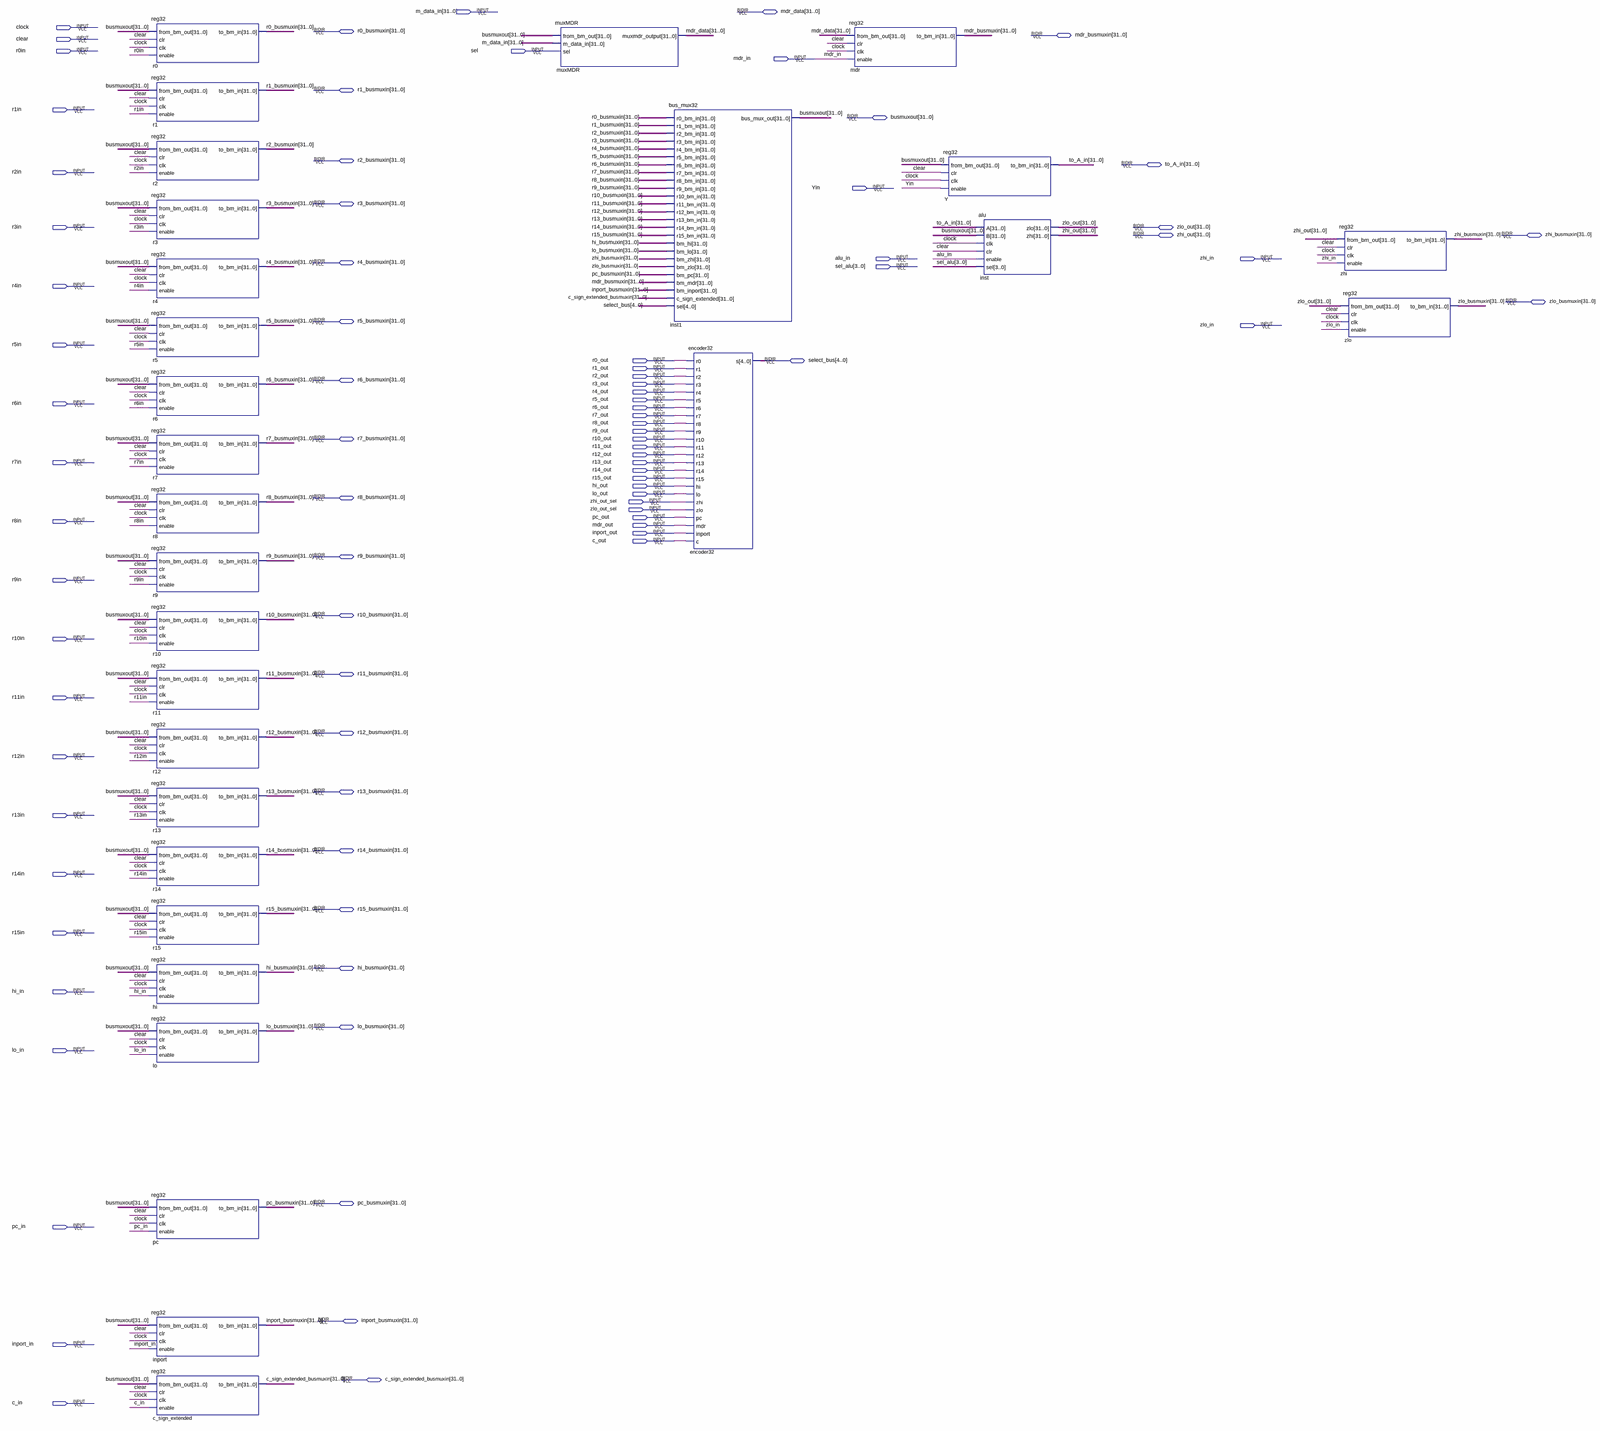
[diagram p0: schematic sheet, whole]
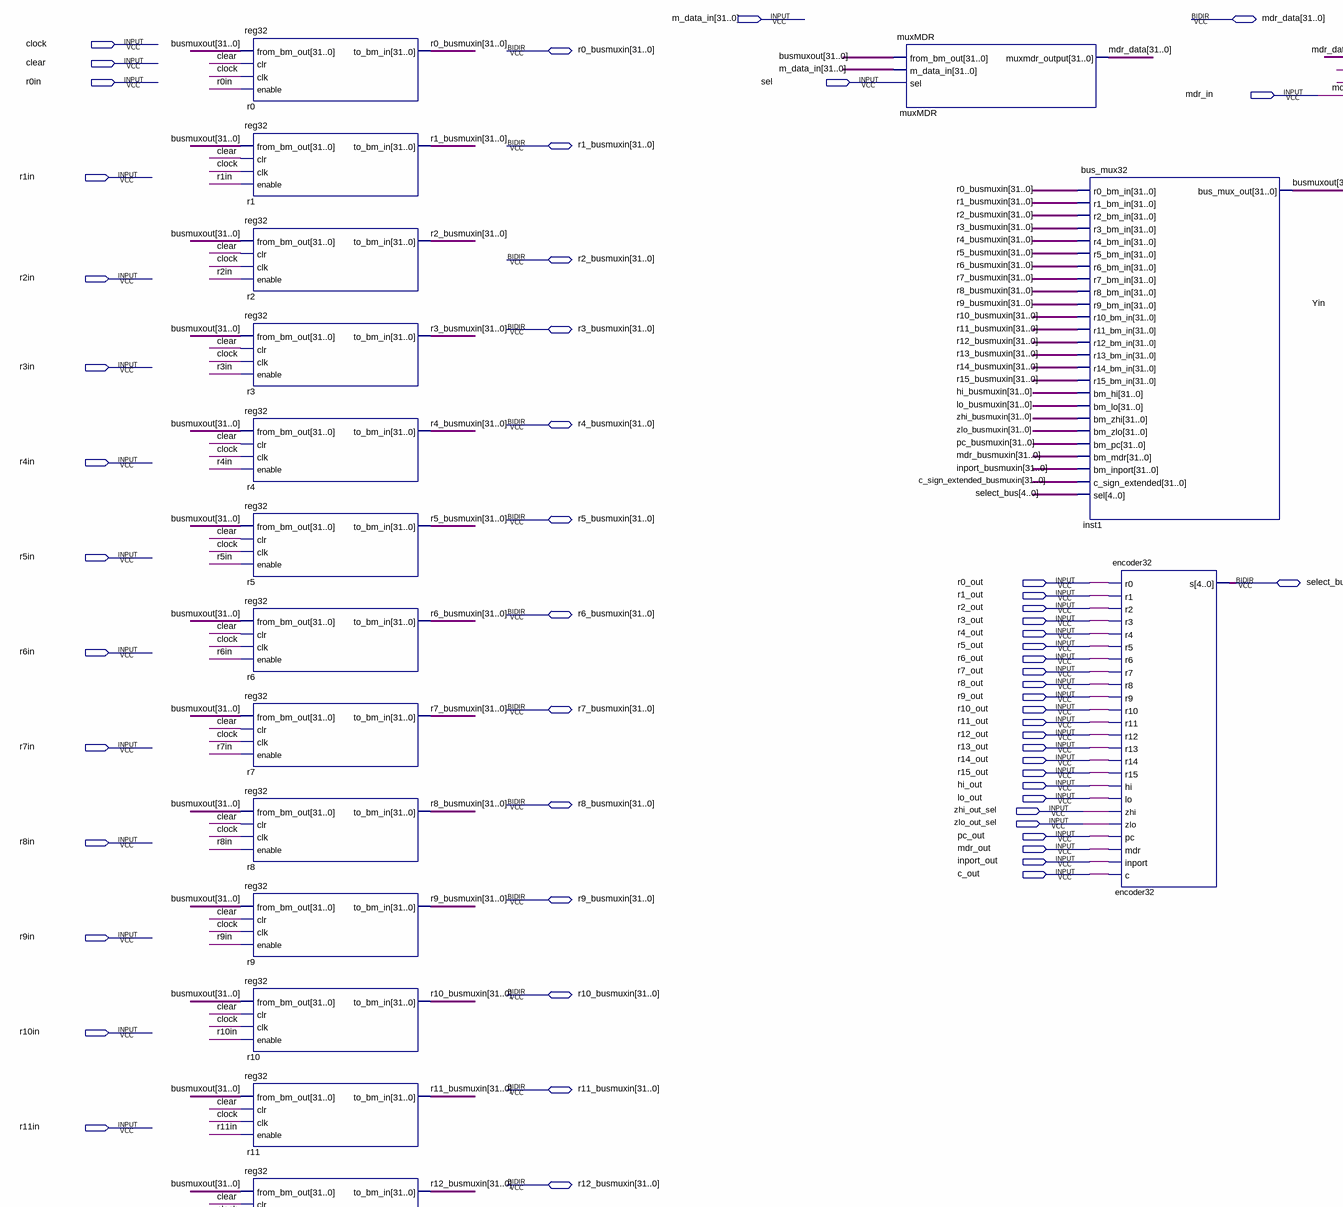
[diagram p1: schematic sheet, upper left part]
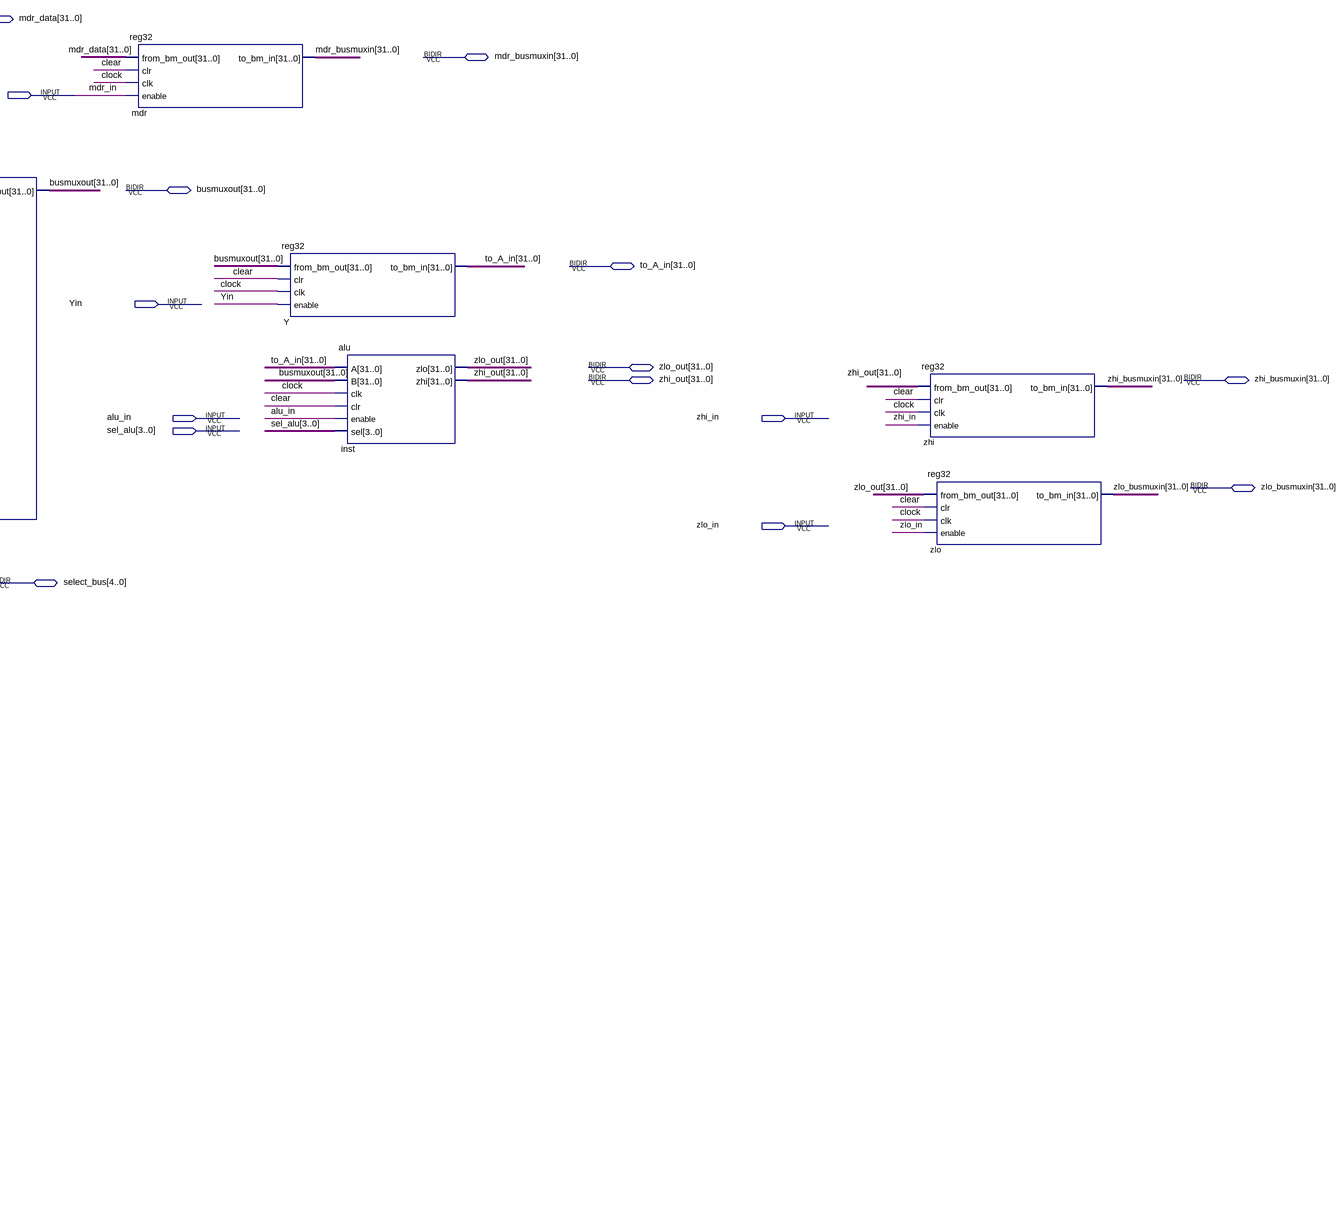
[diagram p2: schematic sheet, upper right part]
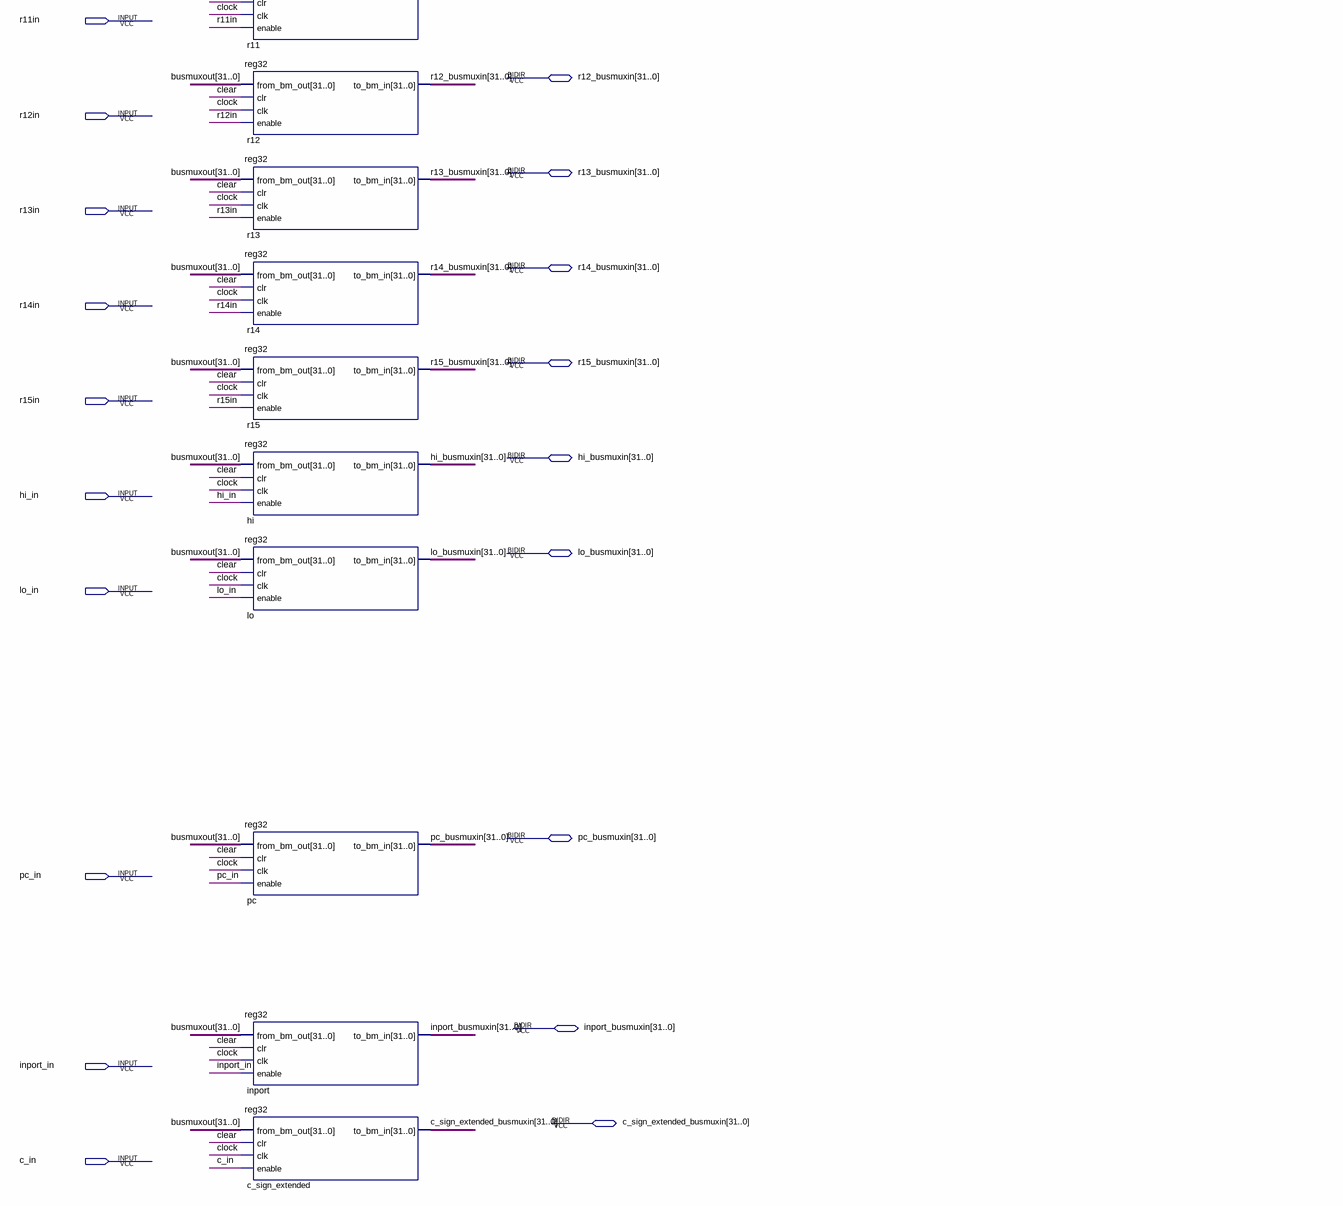
[diagram p3: schematic sheet, lower left part]
// Quartus schematic phase1.bdf as structural Verilog: 29 symbols, 85 pins
module phase1 (
  input  [31:0] m_data_in,
  input  clock,
  input  clear,
  input  r0in,
  input  sel,
  input  mdr_in,
  input  r1in,
  input  r2in,
  input  Yin,
  input  r3in,
  input  alu_in,
  input  zhi_in,
  input  [3:0] sel_alu,
  input  r4in,
  input  zlo_in,
  input  r5in,
  input  r0_out,
  input  r1_out,
  input  r2_out,
  input  r3_out,
  input  r4_out,
  input  r5_out,
  input  r6in,
  input  r6_out,
  input  r7_out,
  input  r8_out,
  input  r9_out,
  input  r10_out,
  input  r11_out,
  input  r12_out,
  input  r7in,
  input  r13_out,
  input  r14_out,
  input  r15_out,
  input  hi_out,
  input  lo_out,
  input  zhi_out_sel,
  input  zlo_out_sel,
  input  pc_out,
  input  r8in,
  input  mdr_out,
  input  inport_out,
  input  c_out,
  input  r9in,
  input  r10in,
  input  r11in,
  input  r12in,
  input  r13in,
  input  r14in,
  input  r15in,
  input  hi_in,
  input  lo_in,
  input  pc_in,
  input  inport_in,
  input  c_in,
  inout  [31:0] mdr_data,
  inout  [31:0] r0_busmuxin,
  inout  [31:0] mdr_busmuxin,
  inout  [31:0] r1_busmuxin,
  inout  [31:0] busmuxout,
  inout  [31:0] r2_busmuxin,
  inout  [31:0] to_A_in,
  inout  [31:0] r3_busmuxin,
  inout  [31:0] zlo_out,
  inout  [31:0] zhi_out,
  inout  [31:0] zhi_busmuxin,
  inout  [31:0] r4_busmuxin,
  inout  [31:0] zlo_busmuxin,
  inout  [31:0] r5_busmuxin,
  inout  [4:0] select_bus,
  inout  [31:0] r6_busmuxin,
  inout  [31:0] r7_busmuxin,
  inout  [31:0] r8_busmuxin,
  inout  [31:0] r9_busmuxin,
  inout  [31:0] r10_busmuxin,
  inout  [31:0] r11_busmuxin,
  inout  [31:0] r12_busmuxin,
  inout  [31:0] r13_busmuxin,
  inout  [31:0] r14_busmuxin,
  inout  [31:0] r15_busmuxin,
  inout  [31:0] hi_busmuxin,
  inout  [31:0] lo_busmuxin,
  inout  [31:0] pc_busmuxin,
  inout  [31:0] inport_busmuxin,
  inout  [31:0] c_sign_extended_busmuxin
);

  reg32 r0 (.from_bm_out(busmuxout), .clr(clear), .clk(clock), .enable(r0in), .to_bm_in(r0_busmuxin));
  reg32 r1 (.from_bm_out(busmuxout), .clr(clear), .clk(clock), .enable(r1in), .to_bm_in(r1_busmuxin));
  reg32 r2 (.from_bm_out(busmuxout), .clr(clear), .clk(clock), .enable(r2in), .to_bm_in(r2_busmuxin));
  reg32 r3 (.from_bm_out(busmuxout), .clr(clear), .clk(clock), .enable(r3in), .to_bm_in(r3_busmuxin));
  reg32 r4 (.from_bm_out(busmuxout), .clr(clear), .clk(clock), .enable(r4in), .to_bm_in(r4_busmuxin));
  reg32 r5 (.from_bm_out(busmuxout), .clr(clear), .clk(clock), .enable(r5in), .to_bm_in(r5_busmuxin));
  reg32 r6 (.from_bm_out(busmuxout), .clr(clear), .clk(clock), .enable(r6in), .to_bm_in(r6_busmuxin));
  reg32 r7 (.from_bm_out(busmuxout), .clr(clear), .clk(clock), .enable(r7in), .to_bm_in(r7_busmuxin));
  reg32 r8 (.from_bm_out(busmuxout), .clr(clear), .clk(clock), .enable(r8in), .to_bm_in(r8_busmuxin));
  reg32 r9 (.from_bm_out(busmuxout), .clr(clear), .clk(clock), .enable(r9in), .to_bm_in(r9_busmuxin));
  reg32 r10 (.from_bm_out(busmuxout), .clr(clear), .clk(clock), .enable(r10in), .to_bm_in(r10_busmuxin));
  reg32 r11 (.from_bm_out(busmuxout), .clr(clear), .clk(clock), .enable(r11in), .to_bm_in(r11_busmuxin));
  reg32 r12 (.from_bm_out(busmuxout), .clr(clear), .clk(clock), .enable(r12in), .to_bm_in(r12_busmuxin));
  reg32 r13 (.from_bm_out(busmuxout), .clr(clear), .clk(clock), .enable(r13in), .to_bm_in(r13_busmuxin));
  reg32 r14 (.from_bm_out(busmuxout), .clr(clear), .clk(clock), .enable(r14in), .to_bm_in(r14_busmuxin));
  reg32 r15 (.from_bm_out(busmuxout), .clr(clear), .clk(clock), .enable(r15in), .to_bm_in(r15_busmuxin));
  reg32 hi (.from_bm_out(busmuxout), .clr(clear), .clk(clock), .enable(hi_in), .to_bm_in(hi_busmuxin));
  reg32 lo (.from_bm_out(busmuxout), .clr(clear), .clk(clock), .enable(lo_in), .to_bm_in(lo_busmuxin));
  reg32 pc (.from_bm_out(busmuxout), .clr(clear), .clk(clock), .enable(pc_in), .to_bm_in(pc_busmuxin));
  reg32 inport (.from_bm_out(busmuxout), .clr(clear), .clk(clock), .enable(inport_in), .to_bm_in(inport_busmuxin));
  reg32 c_sign_extended (
    .from_bm_out(busmuxout), .clr(clear), .clk(clock), .enable(c_in), .to_bm_in(c_sign_extended_busmuxin));
  muxMDR muxMDR (.from_bm_out(busmuxout), .m_data_in(m_data_in), .sel(sel), .muxmdr_output(mdr_data));
  bus_mux32 inst1 (
    .r0_bm_in(r0_busmuxin), .r1_bm_in(r1_busmuxin), .r2_bm_in(r2_busmuxin), .r3_bm_in(r3_busmuxin),
    .r4_bm_in(r4_busmuxin), .r5_bm_in(r5_busmuxin), .r6_bm_in(r6_busmuxin), .r7_bm_in(r7_busmuxin),
    .r8_bm_in(r8_busmuxin), .r9_bm_in(r9_busmuxin), .r10_bm_in(r10_busmuxin), .r11_bm_in(r11_busmuxin),
    .r12_bm_in(r12_busmuxin), .r13_bm_in(r13_busmuxin), .r14_bm_in(r14_busmuxin), .r15_bm_in(r15_busmuxin),
    .bm_hi(hi_busmuxin), .bm_lo(lo_busmuxin), .bm_zhi(zhi_busmuxin), .bm_zlo(zlo_busmuxin),
    .bm_pc(pc_busmuxin), .bm_mdr(mdr_busmuxin), .bm_inport(inport_busmuxin),
    .c_sign_extended(c_sign_extended_busmuxin), .sel(select_bus), .bus_mux_out(busmuxout));
  encoder32 encoder32 (
    .r0(r0_out), .r1(r1_out), .r2(r2_out), .r3(r3_out), .r4(r4_out), .r5(r5_out), .r6(r6_out), .r7(r7_out),
    .r8(r8_out), .r9(r9_out), .r10(r10_out), .r11(r11_out), .r12(r12_out), .r13(r13_out), .r14(r14_out),
    .r15(r15_out), .hi(hi_out), .lo(lo_out), .zhi(zhi_out_sel), .zlo(zlo_out_sel), .pc(pc_out),
    .mdr(mdr_out), .inport(inport_out), .c(c_out), .s(select_bus));
  reg32 mdr (.from_bm_out(mdr_data), .clr(clear), .clk(clock), .enable(mdr_in), .to_bm_in(mdr_busmuxin));
  reg32 Y (.from_bm_out(busmuxout), .clr(clear), .clk(clock), .enable(Yin), .to_bm_in(to_A_in));
  alu inst (
    .A(to_A_in), .B(busmuxout), .clk(clock), .clr(clear), .enable(alu_in), .sel(sel_alu), .zlo(zlo_out),
    .zhi(zhi_out));
  reg32 zhi (.from_bm_out(zhi_out), .clr(clear), .clk(clock), .enable(zhi_in), .to_bm_in(zhi_busmuxin));
  reg32 zlo (.from_bm_out(zlo_out), .clr(clear), .clk(clock), .enable(zlo_in), .to_bm_in(zlo_busmuxin));
endmodule
